# Altium schematic sheet receiver_car_1s.SchDoc
size A3
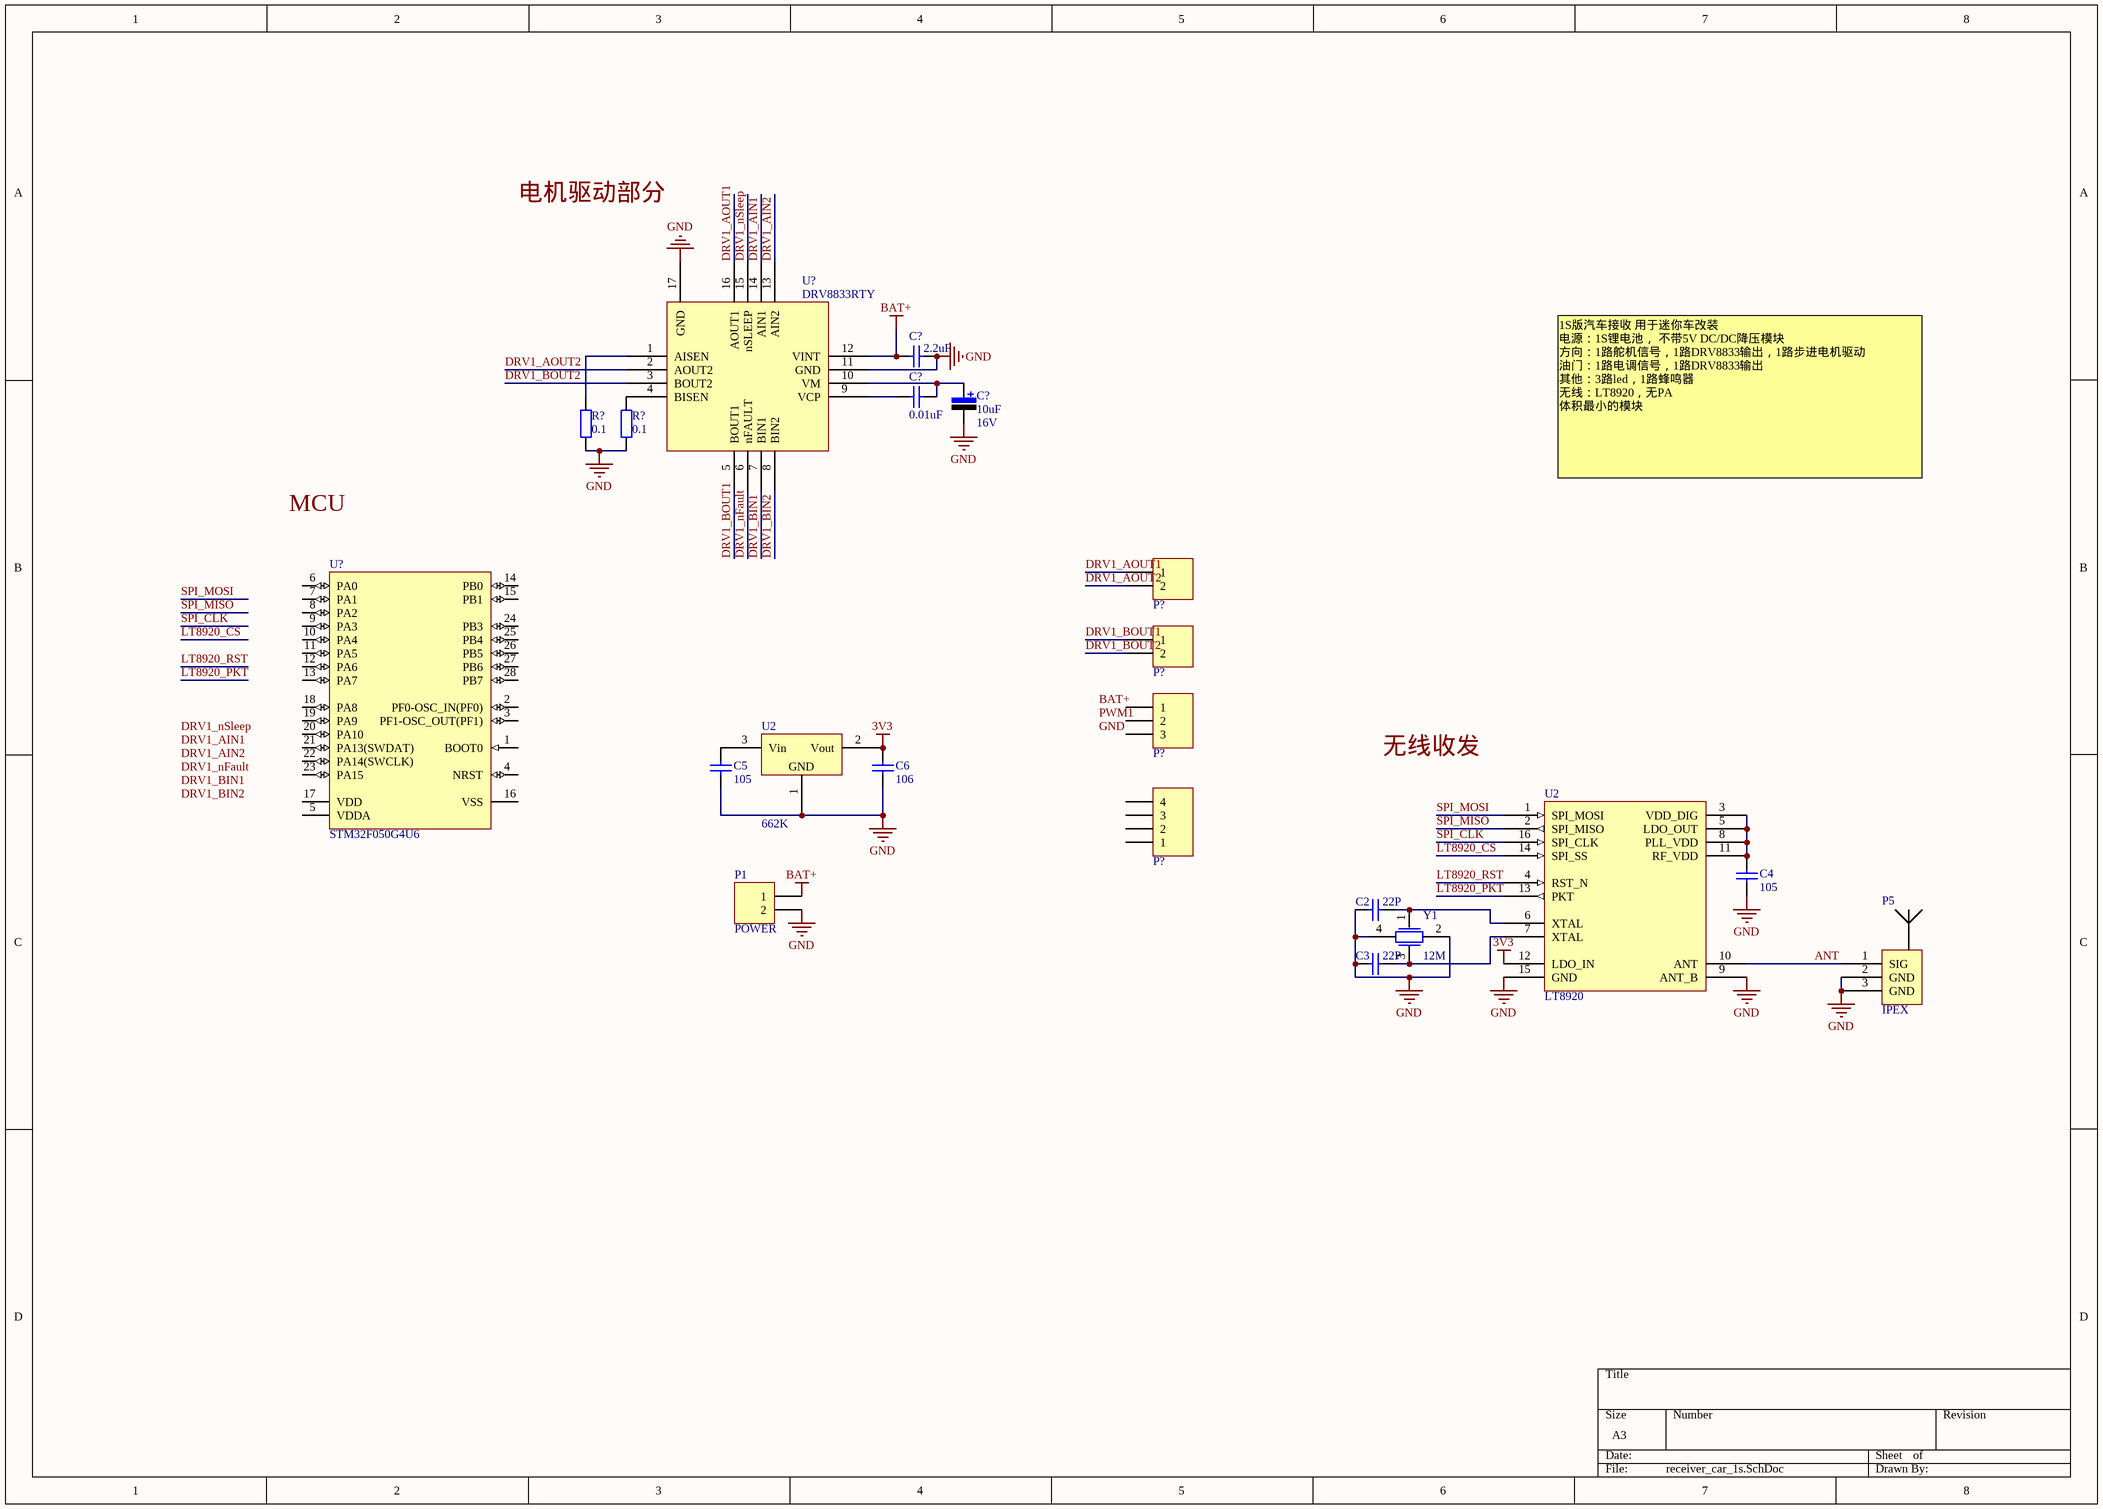
[diagram p0: receiver_car_1s.SchDoc]

## Parts
(Parts that share a designator on the sheet are numbered #1, #2 ... from top to bottom, then left to right.)
C2  value 22P  [0805-2]  (hidden comment: Cap)
C3  value 22P  [0805-2]  (hidden comment: Cap)
C4  value 105  [0805-2]  (hidden comment: Cap)
C5  value 105  [0805-2]  (hidden comment: Cap)
C6  value 106  [0805-2]  (hidden comment: Cap)
C?#1  value 2.2uF  [0805-2]  (hidden comment: Cap)
C?#2  value 0.01uF  [0805-2]  (hidden comment: Cap)
C?#3  value 10uF  Vol: 16V  [C-RB-8]  (hidden comment: Cap Pol)
P1  POWER  [HDR2X1_A]
P5  IPEX  [U.FL-R-SMT]
P?#1  Header 2  [HDR2X1_A]  (value not drawn)
P?#2  Header 2  [HDR2X1_A]  (value not drawn)
P?#3  Header 3  [HDR3X1_A]  (value not drawn)
P?#4  Header 4  [HDR4X1X1.27]  (value not drawn)
R?#1  value 0.1  [0603-1]  (hidden comment: Res1)
R?#2  value 0.1  [0603-1]  (hidden comment: Res1)
U2#1  662K  [SOT-23]
U2#2  LT8920  [SSOP-16 LT8920]
U?#1  DRV8833RTY  [QFN-16 - duplicate1]
U?#2  STM32F050G4U6  [STM-UFQFPN28_V]
Y1  12M  [XTAL_3225]

## Nets
3V3: C6.1 U2#1.2(Vout) U2#2.12(LDO_IN)
BAT+: C?#1.2 P1.1 U?#1.12(VINT)
GND: C2.1 C3.1 C4.1 C5.2 C6.2 C?#1.1 C?#3.2 P1.2 P5.2(GND) P5.3(GND) R?#1.2 R?#2.2 U2#1.1(Vss) U2#2.9(ANT_B) U2#2.15(GND) U?#1.11(GND) U?#1.17(GND) Y1.2 Y1.4
ANT: P5.1(SIG) U2#2.10(ANT)
DRV1_AIN1: U?#1.14(AIN1)
DRV1_AIN2: U?#1.13(AIN2)
DRV1_AOUT1: P?#1.1 U?#1.16(AOUT1)
DRV1_AOUT2: P?#1.2 U?#1.2(AOUT2)
DRV1_BIN1: U?#1.7(BIN1)
DRV1_BIN2: U?#1.8(BIN2)
DRV1_BOUT1: P?#2.1 U?#1.5(BOUT1)
DRV1_BOUT2: P?#2.2 U?#1.3(BOUT2)
DRV1_nFault: U?#1.6(nFAULT)
DRV1_nSleep: U?#1.15(nSLEEP)
LT8920_CS: U2#2.14(SPI_SS)
LT8920_PKT: U2#2.13(PKT)
LT8920_RST: U2#2.4(RST_N)
SPI_CLK: U2#2.16(SPI_CLK)
SPI_MISO: U2#2.2(SPI_MISO)
SPI_MOSI: U2#2.1(SPI_MOSI)
NetC2_2: C2.2 U2#2.6(XTAL) Y1.1
NetC3_2: C3.2 U2#2.7(XTAL) Y1.3
NetC4_2: C4.2 U2#2.3(VDD_DIG) U2#2.5(LDO_OUT) U2#2.8(PLL_VDD) U2#2.11(RF_VDD)
NetC5_1: C5.1 U2#1.3(Vin)
NetC?#2_1: C?#2.1 C?#3.1 U?#1.10(VM)
NetC?#2_2: C?#2.2 U?#1.9(VCP)
NetR?#1_1: R?#1.1 U?#1.1(AISEN)
NetR?#2_1: R?#2.1 U?#1.4(BISEN)

Not connected (* = marked no-connect by the designer): P?#3 1 2 3; P?#4 1 2 3 4; U?#2 1(BOOT0) 2(PF0-OSC_IN(PF0)) 3(PF1-OSC_OUT(PF1)) 4(NRST) 5(VDDA) 6(PA0) 7(PA1) 8(PA2) 9(PA3) 10(PA4) 11(PA5) 12(PA6) 13(PA7) 14(PB0) 15(PB1) 16(VSS) 17(VDD) 18(PA8) 19(PA9) 20(PA10) 21(PA13(SWDAT)) 22(PA14(SWCLK)) 23(PA15) 24(PB3) 25(PB4) 26(PB5) 27(PB6) 28(PB7)

## Notes on the sheet
- 电机驱动部分
- MCU
- 1S版汽车接收 用于迷你车改装
  电源：1S锂电池， 不带5V DC/DC降压模块
  方向：1路舵机信号，1路DRV8833输出，1路步进电机驱动
  油门：1路电调信号，1路DRV8833输出
  其他：3路led，1路蜂鸣器
  无线：LT8920，无PA
  体积最小的模块
- 无线收发
- Labels drawn without touching a wire or pin: BAT+, DRV1_AIN1, DRV1_AIN2, DRV1_BIN1, DRV1_BIN2, DRV1_nFault, DRV1_nSleep, GND, PWM1
- (in symbol 662K) GND

## Library data of the parts
C2-C6 C?#1 C?#2 = Cap: 无极性电容; Published: 8-Jun-2000; LatestRevisionDate: 17-Jul-2002; LatestRevisionNote: Re-released for DXP Platform.; PackageReference: RAD-0.3; Publisher: Altium Limited
C?#3 = Cap Pol: 极性电解电容; Published: 8-Jun-2000; LatestRevisionDate: 17-Jul-2002; LatestRevisionNote: Re-released for DXP Platform.; PackageReference: RB7.6-15; Publisher: Altium Limited
P1 P?#1 P?#2 = Header 2: 接插件; LatestRevisionDate: 17-Jul-2002; LatestRevisionNote: Re-released for DXP Platform.; Publisher: Altium Limited
P5 = IPEX: U.FL-R-SMT
P?#3 = Header 3: 接插件; LatestRevisionDate: 17-Jul-2002; LatestRevisionNote: Re-released for DXP Platform.; Publisher: Altium Limited
P?#4 = Header 4: 接插件; LatestRevisionDate: 17-Jul-2002; LatestRevisionNote: Re-released for DXP Platform.; Publisher: Altium Limited
R?#1 R?#2 = Res1: 贴片电阻; Published: 8-Jun-2000; LatestRevisionDate: 17-Jul-2002; LatestRevisionNote: Re-released for DXP Platform.; PackageReference: AXIAL-0.4; Publisher: Altium Limited
U?#1 = DRV8833RTY: DRV8833_QFN封装
U?#2 = STM32F050G4U6: ARM Cortex-M0 32-bit MCU, 16 KB Flash, 4 KB Internal RAM, 23 I/Os, 28-pin UFQFPN, -40 to 85 degC, Tray; FLASH Size (Prog) (kB): 16; I/Os (High Current): 23; Internal RAM Size (kB): 4; Operating Frequency(F) (Processor speed) (MHz): 48; Supply Voltage(Vcc) min (V): 2; DatasheetVersion: Rev. 1; PackageVersion: Rev. 1, 11/2012; PackageReference: UFQFPN28; PackageDescription: 28-Pin Ultra Thin Fine Pitch Quad Flat No-Lead, 4 x 4 x 0.6 mm Body, 0.5 mm Pitch; Supplier 1: Digi-Key; Supplier Part Number 1: 497-13619-ND; Supplier 2: Farnell; Supplier Part Number 2: 2333137; Supplier 3: Newark; Supplier Part Number 3: 99W9750; Supplier 4: Newark; Supplier Part Number 4: 66W7272; Supplier 5: Mouser; Supplier Part Number 5: 511-STM32F050G4U6; Core: ARM Cortex-M0; Packing: Tray; Mounting Technology: Surface Mount; PartNumber: STM32F050G4U6; ComponentLink1Description: Manufacturer URL; ComponentLink1URL: http://www.st.com/web/en/home.html; ComponentLink2Description: Datasheet; ComponentLink2URL: http://www.st.com/st-web-ui/static/active/en/resource/technical/document/datasheet/DM00065136.pdf; ComponentLink3Description: Package Specification; ComponentLink3URL: http://www.st.com/st-web-ui/static/active/en/resource/technical/document/datasheet/DM00065136.pdf
Y1 = XTAL-4PIN: 贴片晶振